# Altium schematic sheet Ultrascale_EG3.SchDoc
size B; Organization: Altium Limited; Address1: L3, 12a Rodborough Rd; Address2: Frenchs Forest; Address3: NSW; Address4: Australia 2086
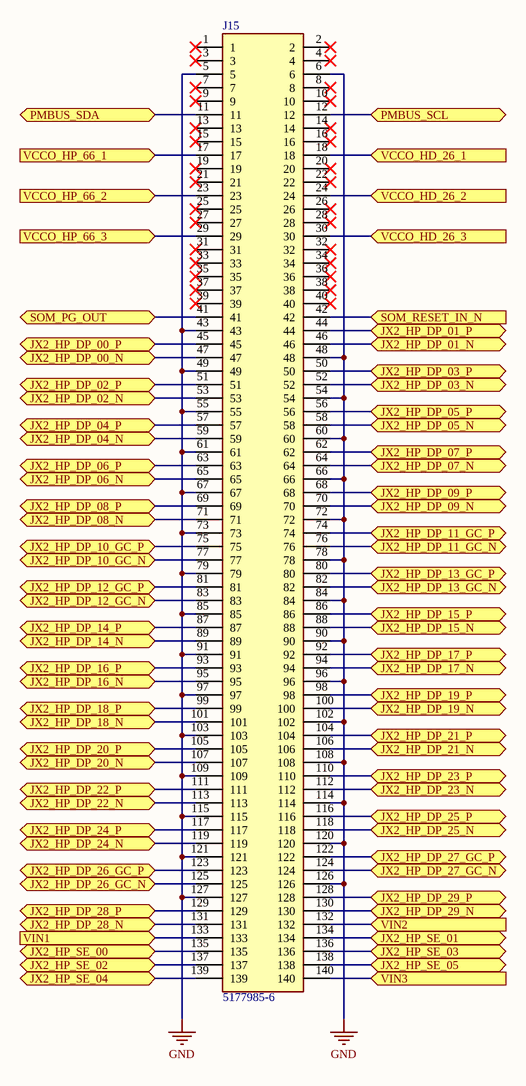
[diagram p0: Ultrascale_EG3.SchDoc]

## Parts
J15  5177985-6  [5177985-6]

## Ports
JX2_HP_DP_00_N (bidir), JX2_HP_DP_00_P (bidir), JX2_HP_DP_01_N (bidir), JX2_HP_DP_01_P (bidir), JX2_HP_DP_02_N (bidir), JX2_HP_DP_02_P (bidir), JX2_HP_DP_03_N (bidir), JX2_HP_DP_03_P (bidir), JX2_HP_DP_04_N (bidir), JX2_HP_DP_04_P (bidir), JX2_HP_DP_05_N (bidir), JX2_HP_DP_05_P (bidir), JX2_HP_DP_06_N (bidir), JX2_HP_DP_06_P (bidir), JX2_HP_DP_07_N (bidir), JX2_HP_DP_07_P (bidir), JX2_HP_DP_08_N (bidir), JX2_HP_DP_08_P (bidir), JX2_HP_DP_09_N (bidir), JX2_HP_DP_09_P (bidir), JX2_HP_DP_10_GC_N (bidir), JX2_HP_DP_10_GC_P (bidir), JX2_HP_DP_11_GC_N (bidir), JX2_HP_DP_11_GC_P (bidir), JX2_HP_DP_12_GC_N (bidir), JX2_HP_DP_12_GC_P (bidir), JX2_HP_DP_13_GC_N (bidir), JX2_HP_DP_13_GC_P (bidir), JX2_HP_DP_14_N (bidir), JX2_HP_DP_14_P (bidir), JX2_HP_DP_15_N (bidir), JX2_HP_DP_15_P (bidir), JX2_HP_DP_16_N (bidir), JX2_HP_DP_16_P (bidir), JX2_HP_DP_17_N (bidir), JX2_HP_DP_17_P (bidir), JX2_HP_DP_18_N (bidir), JX2_HP_DP_18_P (bidir), JX2_HP_DP_19_N (bidir), JX2_HP_DP_19_P (bidir), JX2_HP_DP_20_N (bidir), JX2_HP_DP_20_P (bidir), JX2_HP_DP_21_N (bidir), JX2_HP_DP_21_P (bidir), JX2_HP_DP_22_N (bidir), JX2_HP_DP_22_P (bidir), JX2_HP_DP_23_N (bidir), JX2_HP_DP_23_P (bidir), JX2_HP_DP_24_N (bidir), JX2_HP_DP_24_P (bidir), JX2_HP_DP_25_N (bidir), JX2_HP_DP_25_P (bidir), JX2_HP_DP_26_GC_N (bidir), JX2_HP_DP_26_GC_P (bidir), JX2_HP_DP_27_GC_N (bidir), JX2_HP_DP_27_GC_P (bidir), JX2_HP_DP_28_N (bidir), JX2_HP_DP_28_P (bidir), JX2_HP_DP_29_N (bidir), JX2_HP_DP_29_P (bidir), JX2_HP_SE_00 (bidir), JX2_HP_SE_01 (bidir), JX2_HP_SE_02 (bidir), JX2_HP_SE_03 (bidir), JX2_HP_SE_04 (bidir), JX2_HP_SE_05 (bidir), PMBUS_SCL (bidir), PMBUS_SDA (bidir), SOM_PG_OUT (bidir), SOM_RESET_IN_N (in), VCCO_HD_26_1 (in), VCCO_HD_26_2 (in), VCCO_HD_26_3 (in), VCCO_HP_66_1 (in), VCCO_HP_66_2 (in), VCCO_HP_66_3 (in), VIN1 (in), VIN2 (in), VIN3 (in)

## Nets
GND: J15.5 J15.6 J15.43 J15.48 J15.49 J15.54 J15.55 J15.60 J15.61 J15.66 J15.67 J15.72 J15.73 J15.78 J15.79 J15.84 J15.85 J15.90 J15.91 J15.96 J15.97 J15.102 J15.103 J15.108 J15.109 J15.114 J15.115 J15.120 J15.121 J15.126 J15.127
JX2_HP_DP_00_N: J15.47 ; port JX2_HP_DP_00_N
JX2_HP_DP_00_P: J15.45 ; port JX2_HP_DP_00_P
JX2_HP_DP_01_N: J15.46 ; port JX2_HP_DP_01_N
JX2_HP_DP_01_P: J15.44 ; port JX2_HP_DP_01_P
JX2_HP_DP_02_N: J15.53 ; port JX2_HP_DP_02_N
JX2_HP_DP_02_P: J15.51 ; port JX2_HP_DP_02_P
JX2_HP_DP_03_N: J15.52 ; port JX2_HP_DP_03_N
JX2_HP_DP_03_P: J15.50 ; port JX2_HP_DP_03_P
JX2_HP_DP_04_N: J15.59 ; port JX2_HP_DP_04_N
JX2_HP_DP_04_P: J15.57 ; port JX2_HP_DP_04_P
JX2_HP_DP_05_N: J15.58 ; port JX2_HP_DP_05_N
JX2_HP_DP_05_P: J15.56 ; port JX2_HP_DP_05_P
JX2_HP_DP_06_N: J15.65 ; port JX2_HP_DP_06_N
JX2_HP_DP_06_P: J15.63 ; port JX2_HP_DP_06_P
JX2_HP_DP_07_N: J15.64 ; port JX2_HP_DP_07_N
JX2_HP_DP_07_P: J15.62 ; port JX2_HP_DP_07_P
JX2_HP_DP_08_N: J15.71 ; port JX2_HP_DP_08_N
JX2_HP_DP_08_P: J15.69 ; port JX2_HP_DP_08_P
JX2_HP_DP_09_N: J15.70 ; port JX2_HP_DP_09_N
JX2_HP_DP_09_P: J15.68 ; port JX2_HP_DP_09_P
JX2_HP_DP_10_GC_N: J15.77 ; port JX2_HP_DP_10_GC_N
JX2_HP_DP_10_GC_P: J15.75 ; port JX2_HP_DP_10_GC_P
JX2_HP_DP_11_GC_N: J15.76 ; port JX2_HP_DP_11_GC_N
JX2_HP_DP_11_GC_P: J15.74 ; port JX2_HP_DP_11_GC_P
JX2_HP_DP_12_GC_N: J15.83 ; port JX2_HP_DP_12_GC_N
JX2_HP_DP_12_GC_P: J15.81 ; port JX2_HP_DP_12_GC_P
JX2_HP_DP_13_GC_N: J15.82 ; port JX2_HP_DP_13_GC_N
JX2_HP_DP_13_GC_P: J15.80 ; port JX2_HP_DP_13_GC_P
JX2_HP_DP_14_N: J15.89 ; port JX2_HP_DP_14_N
JX2_HP_DP_14_P: J15.87 ; port JX2_HP_DP_14_P
JX2_HP_DP_15_N: J15.88 ; port JX2_HP_DP_15_N
JX2_HP_DP_15_P: J15.86 ; port JX2_HP_DP_15_P
JX2_HP_DP_16_N: J15.95 ; port JX2_HP_DP_16_N
JX2_HP_DP_16_P: J15.93 ; port JX2_HP_DP_16_P
JX2_HP_DP_17_N: J15.94 ; port JX2_HP_DP_17_N
JX2_HP_DP_17_P: J15.92 ; port JX2_HP_DP_17_P
JX2_HP_DP_18_N: J15.101 ; port JX2_HP_DP_18_N
JX2_HP_DP_18_P: J15.99 ; port JX2_HP_DP_18_P
JX2_HP_DP_19_N: J15.100 ; port JX2_HP_DP_19_N
JX2_HP_DP_19_P: J15.98 ; port JX2_HP_DP_19_P
JX2_HP_DP_20_N: J15.107 ; port JX2_HP_DP_20_N
JX2_HP_DP_20_P: J15.105 ; port JX2_HP_DP_20_P
JX2_HP_DP_21_N: J15.106 ; port JX2_HP_DP_21_N
JX2_HP_DP_21_P: J15.104 ; port JX2_HP_DP_21_P
JX2_HP_DP_22_N: J15.113 ; port JX2_HP_DP_22_N
JX2_HP_DP_22_P: J15.111 ; port JX2_HP_DP_22_P
JX2_HP_DP_23_N: J15.112 ; port JX2_HP_DP_23_N
JX2_HP_DP_23_P: J15.110 ; port JX2_HP_DP_23_P
JX2_HP_DP_24_N: J15.119 ; port JX2_HP_DP_24_N
JX2_HP_DP_24_P: J15.117 ; port JX2_HP_DP_24_P
JX2_HP_DP_25_N: J15.118 ; port JX2_HP_DP_25_N
JX2_HP_DP_25_P: J15.116 ; port JX2_HP_DP_25_P
JX2_HP_DP_26_GC_N: J15.125 ; port JX2_HP_DP_26_GC_N
JX2_HP_DP_26_GC_P: J15.123 ; port JX2_HP_DP_26_GC_P
JX2_HP_DP_27_GC_N: J15.124 ; port JX2_HP_DP_27_GC_N
JX2_HP_DP_27_GC_P: J15.122 ; port JX2_HP_DP_27_GC_P
JX2_HP_DP_28_N: J15.131 ; port JX2_HP_DP_28_N
JX2_HP_DP_28_P: J15.129 ; port JX2_HP_DP_28_P
JX2_HP_DP_29_N: J15.130 ; port JX2_HP_DP_29_N
JX2_HP_DP_29_P: J15.128 ; port JX2_HP_DP_29_P
JX2_HP_SE_00: J15.135 ; port JX2_HP_SE_00
JX2_HP_SE_01: J15.134 ; port JX2_HP_SE_01
JX2_HP_SE_02: J15.137 ; port JX2_HP_SE_02
JX2_HP_SE_03: J15.136 ; port JX2_HP_SE_03
JX2_HP_SE_04: J15.139 ; port JX2_HP_SE_04
JX2_HP_SE_05: J15.138 ; port JX2_HP_SE_05
PMBUS_SCL: J15.12 ; port PMBUS_SCL
PMBUS_SDA: J15.11 ; port PMBUS_SDA
SOM_PG_OUT: J15.41 ; port SOM_PG_OUT
SOM_RESET_IN_N: J15.42 ; port SOM_RESET_IN_N
VCCO_HD_26_1: J15.18 ; port VCCO_HD_26_1
VCCO_HD_26_2: J15.24 ; port VCCO_HD_26_2
VCCO_HD_26_3: J15.30 ; port VCCO_HD_26_3
VCCO_HP_66_1: J15.17 ; port VCCO_HP_66_1
VCCO_HP_66_2: J15.23 ; port VCCO_HP_66_2
VCCO_HP_66_3: J15.29 ; port VCCO_HP_66_3
VIN1: J15.133 ; port VIN1
VIN2: J15.132 ; port VIN2
VIN3: J15.140 ; port VIN3

Not connected (* = marked no-connect by the designer): J15 1* 2* 3* 4* 7* 8* 9* 10* 13* 14* 15* 16* 19* 20* 21* 22* 25* 26* 27* 28* 31* 32* 33* 34* 35* 36* 37* 38* 39* 40*

## Notes on the sheet
- Title
- Size:
- Date:
- B
- Number:
- Time:
- Revision:
- Sheet
- of
- File:

## Library data of the parts
J15 = 5177985-6: Connector; Manufacturer_Name: TE Connectivity; Datasheet Link: https://www.te.com/commerce/DocumentDelivery/DDEController?Action=srchrtrv&DocNm=5177985&DocType=Customer+Drawing&DocLang=English&DocFormat=pdf&PartCntxt=5177985-6; Manufacturer_Part_Number: 5177985-6; Mouser Part Number: 571-5177985-6; Mouser Price/Stock: https://www.mouser.com/Search/Refine.aspx?Keyword=571-5177985-6